# EAGLE design Lipo-ds2764-v02 (EAGLE 5.10)
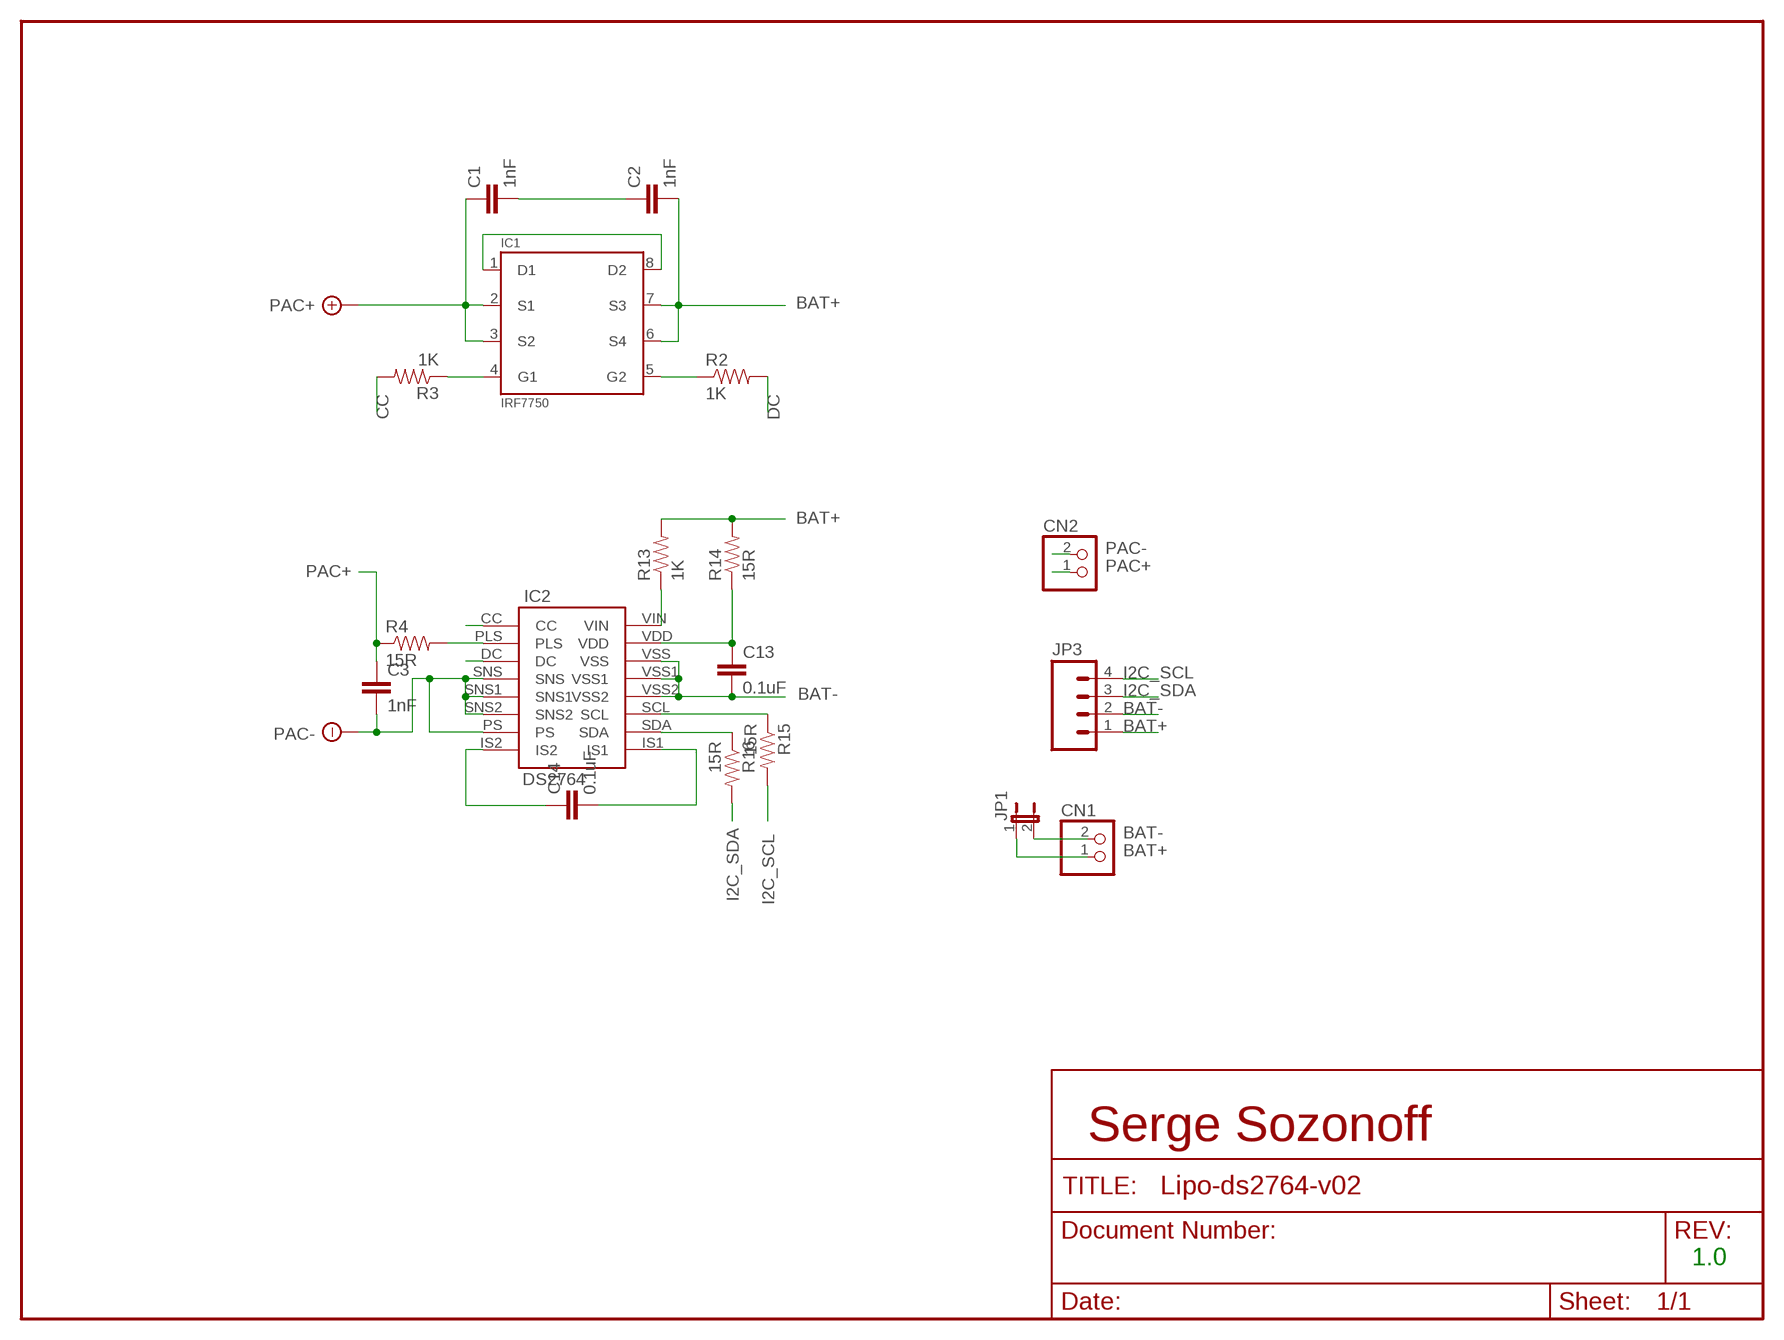
[diagram p0: schematic, sheet 1]

## Parts
C1  1nF  CAP0603-CAP  [0603-CAP]
C2  1nF  CAP0603-CAP  [0603-CAP]
C3  1nF  CAP0603-CAP  [0603-CAP]
C13  0.1uF  CAP0603-CAP  [0603-CAP]
C14  0.1uF  CAP0603-CAP  [0603-CAP]
CN1  JST_2PIN-THM-RA  [JST-PH-2-THM-RA]
CN2  JST_2PIN-THM-RA  [JST-PH-2-THM-RA]
IC1  IRF7750  [TSSOP8-4.4MM]
IC2  DS2764  [DS2764]
JP1  JUMPER-2PTH  [1X02]
JP3  M04PTH  [1X04]
R2  1K  RESISTOR0603-RES  [0603-RES]
R3  1K  RESISTOR0603-RES  [0603-RES]
R4  15R  RESISTOR0603-RES  [0603-RES]
R13  1K  RESISTOR0603-RES  [0603-RES]
R14  15R  RESISTOR0603-RES  [0603-RES]
R15  15R  RESISTOR0603-RES  [0603-RES]
R16  15R  RESISTOR0603-RES  [0603-RES]

## Nets
BAT+: C2.2 CN1.1 IC1.6(S4) IC1.7(S3) JP1.1 JP3.1 R13.2 R14.2
BAT-: C13.2 CN1.2 IC2.VSS IC2.VSS1 IC2.VSS2 JP1.2 JP3.2
CC: IC2.CC R3.2
DC: IC2.DC R2.2
I2C_SCL: JP3.4 R15.2
I2C_SDA: JP3.3 R16.2
N$1: IC2.SCL R15.1
N$2: IC1.4(G1) R3.1
N$3: IC1.1(D1) IC1.8(D2)
N$4: IC1.5(G2) R2.1
N$6: C1.2 C2.1
N$11: IC2.VIN R13.1
N$18: C13.1 IC2.VDD R14.1
N$21: C14.2 IC2.IS1
N$24: C14.1 IC2.IS2
N$25: IC2.SDA R16.1
PAC+: C1.1 C3.1 CN2.1 IC1.2(S1) IC1.3(S2) R4.1
PAC-: C3.2 CN2.2 IC2.PS IC2.SNS IC2.SNS1 IC2.SNS2
PLS: IC2.PLS R4.2

## Notes on the sheet
- Serge Sozonoff
- 1.0

## Library data of the parts
C1-C3 C13 C14 = SparkFun:CAP: Capacitor Standard 0603 ceramic capacitor, and 0.1" leaded capacitor.
CN1 CN2 = adafruit:JST_2PIN: JST 2-Pin Connectors of various flavors SMT-RA (S2B-PH-SM4) 4UConnector #17311 SMT (B2B-PH-SM4) THM-RA (S2B-PH) THM (B2B-PH)
IC1 = ssozonoff:IRF7750: HEXFET® power MOSFETs from International Rectifier utilize advanced processing techniques to achieve extremely low on-resistance per silicon area. This benefit, combined with the ruggedized device design, that International Rectifier is well known for, provides the designer with an extremely efficient and reliable device for battery and load management.
IC2 = ssozonoff:DS2764
JP1 = SparkFun:JUMPER-2: Jumper Basic 0.1" spaced jumper. Use with breakaway headers.
JP3 = SparkFun:M04: Header 4 Standard 4-pin 0.1" header. Use with straight break away headers (SKU : PRT-00116), right angle break away headers (PRT-00553), swiss pins (PRT-00743), machine pins (PRT-00117), and female headers (PRT-00115). Molex polarized connector foot print use with SKU : PRT-08231 with associated crimp pins and housings.
R2-R4 R13-R16 = SparkFun:RESISTOR: Resistor Basic schematic elements and footprints for 0603, 1206, and PTH 1/10th watt (small) resistors.

## Board
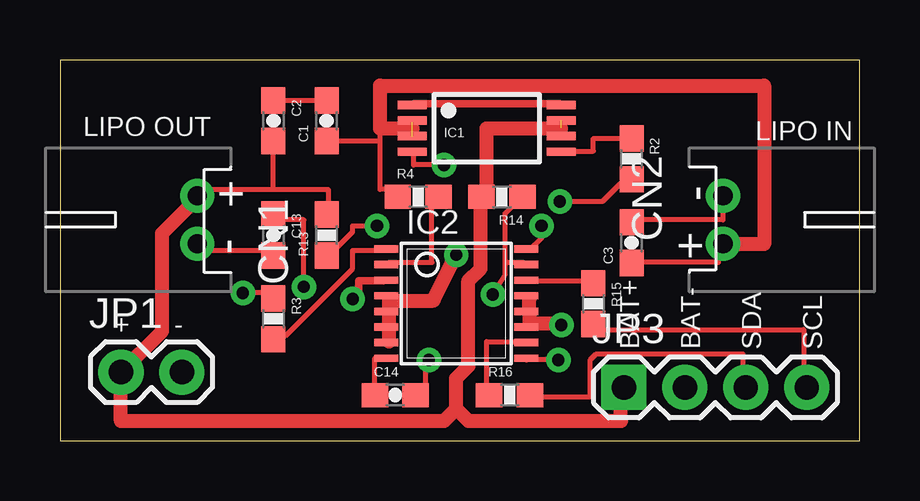
[diagram p1: board, top side]
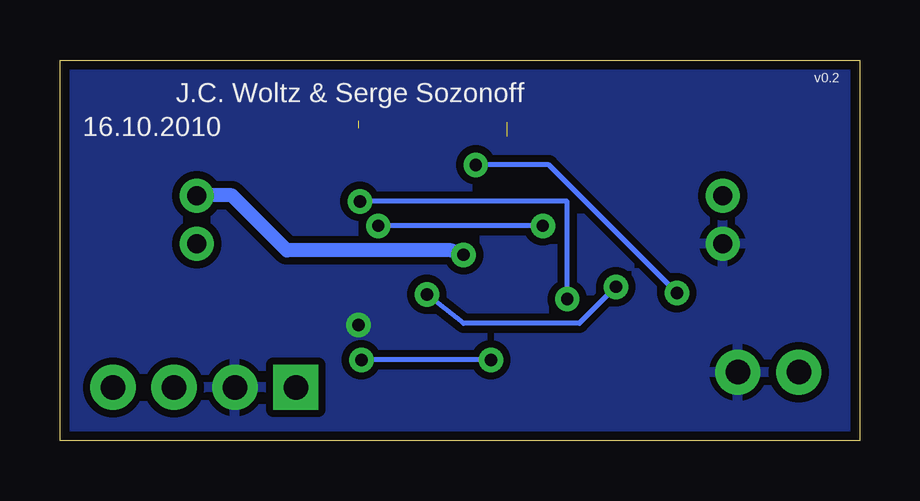
[diagram p2: board, bottom side, seen from below]

Size 33.33 x 15.87 mm. Coordinates in mm from the lower left corner, seen from the top.
Outline: 0,0 33.33,0 33.33,15.86 0,15.86 0,0
Copper layers (1*16): Top 0.0356mm / dielectric 1.5011mm / Bottom 0.0356mm
Design rules "LaenPCBOrder *": minimum track width 8mil, minimum drill 13mil, track to track 6mil, track to pad 6mil, pad to pad 6mil, via to via 6mil, smd to smd 6mil, copper to edge 15mil, drill to drill 6mil, minimum pad ring 12mil, minimum via ring 10mil, stop-mask expansion 4mil, vias tented up to drill 25mil, thermal gap 10mil

### Footprints (pad centres in the part's own frame; a part is rotated, then mirrored left to right if it is on the bottom)
0603-CAP = smd 1.1 x 1: 1 -0.85,0; 2 0.85,0
JST-PH-2-THM-RA = drill 0.8 pad 1.422 round: 1 1,0; 2 -1,0
TSSOP8-4.4MM = smd 1.2 x 0.35: 1 -3.1,0.975; 2 -3.1,0.325; 3 -3.1,-0.325; 4 -3.1,-0.975; 5 3.1,-0.975; 6 3.1,-0.325; 7 3.1,0.325; 8 3.1,0.975
DS2764 = smd 0.305 x 0.991: CC -2.275,-2.918; DC -0.975,-2.918; IS1 2.275,2.918; IS2 2.275,-2.918; PLS -1.625,-2.918; PS 1.625,-2.918; SCL -0.975,2.918; SDA 1.625,2.918; SNS -0.325,-2.918; SNS1 0.325,-2.918; SNS2 0.975,-2.918; VDD -1.625,2.918; VIN -2.275,2.918; VSS -0.325,2.918; VSS1 0.325,2.918; VSS2 0.975,2.918
1X02 = drill 1.016 pad 1.88 round: 1 0,0; 2 2.54,0
1X04 = drill 1.016 pad 1.88 square: 1 0,0 | drill 1.016 pad 1.88 round: 2 2.54,0; 3 5.08,0; 4 7.62,0
0603-RES = smd 1.1 x 1: 1 -0.85,0; 2 0.85,0

### Placement (x,y rotation side)
C1  11.11,13.34 90 top
C2  8.89,13.34 270 top
C3  23.81,8.26 90 top
C13  8.89,8.57 270 top
C14  13.97,1.9 0 top
CN1  5.71,9.21 90 top
CN2  27.62,9.21 270 top
IC1  17.78,13.02 0 top
IC2  16.51,5.71 270 top
JP1  2.54,2.86 0 top
JP3  23.5,2.22 0 top
R2  23.81,11.75 270 top
R3  8.89,5.08 270 top
R4  14.92,10.16 0 top
R13  11.11,8.57 90 top
R14  18.41,10.16 180 top
R15  22.23,5.71 270 top
R16  18.73,1.9 0 top

### Tracks (layer width: path | path; a pad name or v marks a point on that pad's centre or on a via)
BAT+  (1 unrouted)
  Top 0.203: 11.18,9.46 11.18,10.48 8.89,10.48 | 8.89,10.48 5.84,10.48 5.84,10.22 | 8.89,10.48 C2.2 | R14.2 17.78,10.16 | 20.88,13.02 IC1.6
  Top 0.305: 17.53,9.97 R14.2 | 23.37,2.1 JP3.1 | 11.18,9.46 R13.2 | CN1.1 5.84,10.22
  Top 0.584: 17.53,9.97 17.53,7.18 17.02,6.67 17.02,3.11 16.51,2.6 16.51,1.33 | 16.51,1.33 17.02,0.83 23.37,0.83 23.37,2.1 | CN1.1 5.59,9.97 4.25,8.64 4.25,4.57 JP1.1 2.54,0.83 16,0.83 16.51,1.33 | 17.78,10.16 17.78,13.02 20.88,13.02
BAT-  (via drill 0.51)
  Top 0.203: 8.89,7.94 5.71,7.94 CN1.2
  Top 0.305: 19.56,4.89 IC2.VSS2 | 19.56,5.91 IC2.VSS | IC2.VSS1 19.56,5.4 | 8.89,7.94 C13.2
  Top 0.584: 19.56,5.91 19.56,5.4 19.56,4.89 20.57,4.89 v20.89,4.83
  pour Bottom (isolate 0.305): 0,15.56 33.02,15.56 33.02,0.32 0,0.32
CC
  Top 0.203: 8.89,4.38 9.4,4.38 12.19,7.18 12.19,7.94 13.46,7.94 IC2.CC
  Top 0.305: R3.2 8.89,4.38
DC  (via drill 0.51)
  Top 0.203: v20.83,9.97 22.61,9.97 23.37,10.73 R2.2
  Top 0.305: v12.19,5.91 12.45,6.16 12.45,6.67 13.46,6.67 IC2.DC
  Bottom 0.203: v12.19,5.91 12.19,9.97 v20.83,9.97
I2C_SCL
  Top 0.203: 22.1,4.64 30.99,4.64 30.99,2.35 JP3.4
  Top 0.305: R15.2 22.1,4.64
I2C_SDA
  Top 0.203: 19.3,1.84 22.1,1.84 22.1,3.37 22.35,3.62 28.45,3.62 28.45,2.35 JP3.3
  Top 0.305: R16.2 19.3,1.84
N$1
  Top 0.203: 21.84,6.67 19.56,6.67 IC2.SCL
  Top 0.305: 21.84,6.67 R15.1
N$2  (via drill 0.51)
  Top 0.203: 8.89,6.16 v7.62,6.16 | v16,11.49 14.73,11.49 14.73,12
  Top 0.305: R3.1 8.89,6.16 | 14.73,12 IC1.4
  Bottom 0.203: v7.62,6.16 12.95,11.49 v16,11.49
N$3
  Top 0.305: IC1.1 14.73,14.03 20.83,14.03 IC1.8
N$4
  Top 0.203: R2.1 22.23,12.6 22.23,12.07 20.88,12.07 IC1.5
N$6
  Top 0.203: C2.1 C1.2
N$11  (via drill 0.51)
  Top 0.203: v20.07,8.95 20.07,8.45 19.56,7.94 IC2.VIN | v13.21,8.95 12.19,8.95 12.19,8.7 11.18,7.68
  Top 0.305: R13.1 11.18,7.68
  Bottom 0.203: v13.21,8.95 v20.07,8.95
N$18  (via drill 0.51)
  Top 0.203: 18.54,7.43 19.3,7.43 IC2.VDD | 18.54,7.43 18.54,9.46 19.05,9.97 | v10.16,6.41 10.16,9.21 8.89,9.21 | v18.03,6.1 18.54,6.92 18.54,7.43
  Top 0.305: 19.05,9.97 R14.1 | 8.89,9.21 C13.1
  Bottom 0.203: v10.16,6.41 11.68,4.89 16.51,4.89 v18.03,6.1
N$21  (via drill 0.51)
  Top 0.203: v15.37,3.37 15.24,3.37 15.24,1.59 14.82,1.59 C14.2 | v20.77,3.37 19.43,3.37 IC2.IS1
  Bottom 0.203: v15.37,3.37 v20.77,3.37
N$24
  Top 0.203: IC2.IS2 13.12,3.44 C14.1
N$25
  Top 0.203: 17.78,2.1 17.78,4.13 19.3,4.13 IC2.SDA
  Top 0.305: R16.1 17.78,2.1
PAC+  (2 unrouted)
  Top 0.203: IC1.2 14.48,13.27 14.68,13.27 | 23.62,7.43 27.43,7.43 27.43,8.19 CN2.1 27.62,8.19 | 13.34,12.49 C1.1 | 13.34,12.49 13.34,13.02 | 13.72,10.48 13.34,10.48 13.34,12.49
  Top 0.305: 13.72,10.48 13.97,10.22 R4.1 | 23.62,7.43 C3.1
  Top 0.584: 14.68,13.02 13.34,13.02 13.34,14.8 29.34,14.8 29.34,8.19 27.62,8.19
PAC-  (via drill 0.51)
  Top 0.203: 23.62,9.21 27.62,9.21 CN2.2
  Top 0.305: IC2.PS 13.72,4.13 | 13.72,4.64 IC2.SNS2 13.72,4.89 | 13.72,5.91 IC2.SNS 13.72,5.84 | 13.72,5.4 IC2.SNS1 | 23.62,9.21 C3.2
  Top 0.584: 13.72,4.13 13.72,4.64 | 13.72,5.84 13.72,5.4 13.72,4.89 | 13.72,5.84 13.72,5.91 | 13.72,5.84 15.56,5.84 v16.51,7.75
  Bottom 0.305: 27.43,10.22 CN2.2
  Bottom 0.584: v16.51,7.75 17.02,7.94 23.88,7.94 26.16,10.22 27.43,10.22
PLS
  Top 0.203: 15.75,9.97 15.49,9.72 15.49,7.43 13.72,7.43 IC2.PLS
  Top 0.305: 15.75,9.97 R4.2

### Text on the board
tPlace: LIPO IN | LIPO OUT | + | - | BAT+ | BAT- | SDA | SCL
bPlace: v0.2 | J.C. Woltz & Serge Sozonoff | 16.10.2010